# Altium project sme-pcb-energysolution-s01.PrjPcb
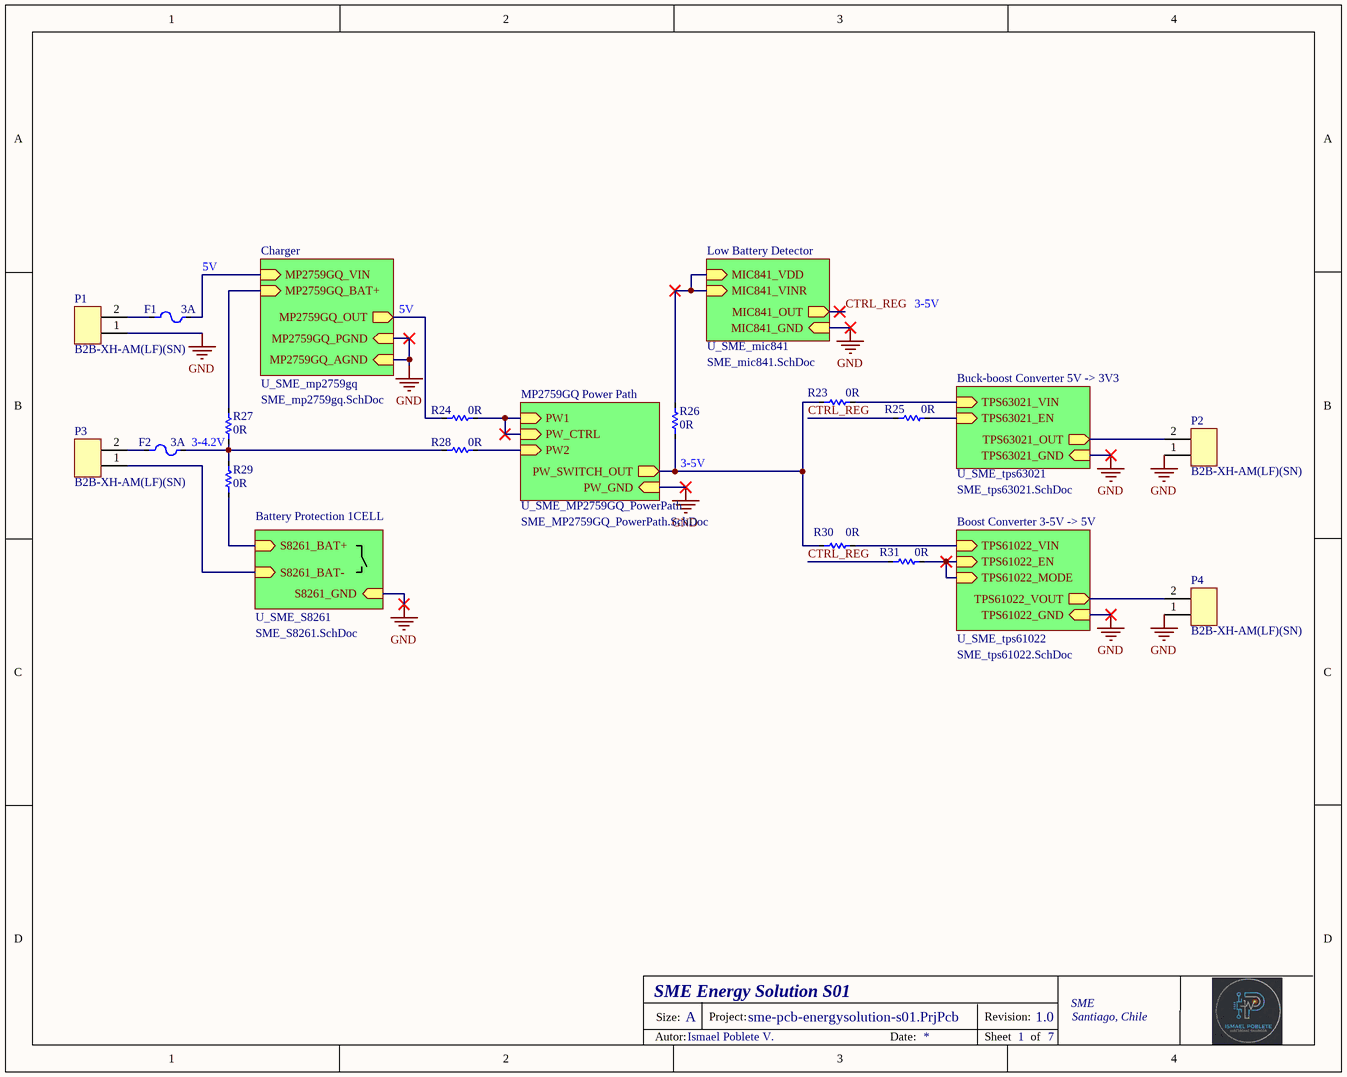
[diagram p0: SME_Main.SchDoc]
7 sheets, 73 parts. Net scope: hierarchical (ports join the sheet entries above them; power ports are global).
Board file: PCB_s01.PcbDoc
Sheets:
  SME_Main.SchDoc
    U_SME_mic841 = SME_mic841.SchDoc
    U_SME_S8261 = SME_S8261.SchDoc
    U_SME_mp2759gq = SME_mp2759gq.SchDoc
    U_SME_tps61022 = SME_tps61022.SchDoc
    U_SME_tps63021 = SME_tps63021.SchDoc
    U_SME_MP2759GQ_PowerPath = SME_MP2759GQ_PowerPath.SchDoc

## Sheet SME_Main.SchDoc: Titulo
size OrCAD A; Author: Ismael Poblete V.; CompanyName: SME; Organization: SME; Address1: Santiago, Chile; DocumentNumber: SME-UNO; Revision: 1.0; SheetNumber: 1; SheetTotal: 7

### Parts
F1  Fuse value: 3A  [Fuse 22.7mm - 2 Hole]  (hidden comment: FUSE - Littelfuse)
F2  Fuse value: 3A  [Fuse 22.7mm - 2 Hole]  (hidden comment: FUSE - Littelfuse)
P1  B2B-XH-AM(LF)(SN)  [2Pin JST XH-2.54mm]
P2  B2B-XH-AM(LF)(SN)  [2Pin JST XH-2.54mm]
P3  B2B-XH-AM(LF)(SN)  [2Pin JST XH-2.54mm]
P4  B2B-XH-AM(LF)(SN)  [2Pin JST XH-2.54mm]
R23  Resistance: 0R  [RES_1206]  (hidden comment: RC1206FR-070RL)
R24  Resistance: 0R  [RES_1206]  (hidden comment: RC1206FR-070RL)
R25  Resistance: 0R  [RES_1206]  (hidden comment: RC1206FR-070RL)
R26  Resistance: 0R  [RES_1206]  (hidden comment: RC1206FR-070RL)
R27  Resistance: 0R  [RES_1206]  (hidden comment: RC1206FR-070RL)
R28  Resistance: 0R  [RES_1206]  (hidden comment: RC1206FR-070RL)
R29  Resistance: 0R  [RES_1206]  (hidden comment: RC1206FR-070RL)
R30  Resistance: 0R  [RES_1206]  (hidden comment: RC1206FR-070RL)
R31  Resistance: 0R  [RES_1206]  (hidden comment: RC1206FR-070RL)

### Sub-sheets
U_SME_mic841 = SME_mic841.SchDoc: MIC841_VDD (in), MIC841_VINR (in), MIC841_OUT (out), MIC841_GND (in)
U_SME_mp2759gq = SME_mp2759gq.SchDoc: MP2759GQ_VIN (in), MP2759GQ_OUT (out), MP2759GQ_BAT+ (in), MP2759GQ_AGND (in), MP2759GQ_PGND (in)
U_SME_MP2759GQ_PowerPath = SME_MP2759GQ_PowerPath.SchDoc: PW_SWITCH_OUT (out), PW1 (in), PW2 (in), PW_CTRL (in), PW_GND (in)
U_SME_S8261 = SME_S8261.SchDoc: S8261_BAT+ (in), S8261_BAT- (in), S8261_GND (in)
U_SME_tps61022 = SME_tps61022.SchDoc: TPS61022_VIN (in), TPS61022_EN (in), TPS61022_MODE (in), TPS61022_VOUT (out), TPS61022_GND (in)
U_SME_tps63021 = SME_tps63021.SchDoc: TPS63021_VIN (in), TPS63021_OUT (out), TPS63021_EN (in), TPS63021_GND (in)

### Nets
GND: P1.1 P2.1 P4.1 ; sheet U_SME_mic841/MIC841_GND, sheet U_SME_S8261/S8261_GND, sheet U_SME_mp2759gq/MP2759GQ_AGND, sheet U_SME_mp2759gq/MP2759GQ_PGND, sheet U_SME_tps61022/TPS61022_GND, sheet U_SME_tps63021/TPS63021_GND, sheet U_SME_MP2759GQ_PowerPath/PW_GND  [project net MP2759GQ_AGND]
CTRL_REG: R25.1 R31.1 ; sheet U_SME_mic841/MIC841_OUT
MP2759GQ_BAT+: R27.2 ; sheet U_SME_mp2759gq/MP2759GQ_BAT+
MP2759GQ_VIN: F1.2 ; sheet U_SME_mp2759gq/MP2759GQ_VIN
NetC1_1: R23.2 ; sheet U_SME_tps63021/TPS63021_VIN
NetC3_1: P2.2 ; sheet U_SME_tps63021/TPS63021_OUT
NetC9_2: R24.1 ; sheet U_SME_mp2759gq/MP2759GQ_OUT
NetC13_1: R30.2 ; sheet U_SME_tps61022/TPS61022_VIN
NetC15_1: P4.2 ; sheet U_SME_tps61022/TPS61022_VOUT
NetC18_1: P3.1 ; sheet U_SME_S8261/S8261_BAT-
NetD2_1: R23.1 R24.2 R26.1 R30.1 ; sheet U_SME_MP2759GQ_PowerPath/PW_SWITCH_OUT, sheet U_SME_MP2759GQ_PowerPath/PW1, sheet U_SME_MP2759GQ_PowerPath/PW_CTRL
NetF1_1: F1.1 P1.2
NetF2_1: F2.1 P3.2
NetF2_2: F2.2 R27.1 R28.1 R29.2
NetQ3_3: R28.2 ; sheet U_SME_MP2759GQ_PowerPath/PW2
NetR1_2: R26.2 ; sheet U_SME_mic841/MIC841_VDD, sheet U_SME_mic841/MIC841_VINR
NetR8_1: R25.2 ; sheet U_SME_tps63021/TPS63021_EN
NetR21_1: R29.1 ; sheet U_SME_S8261/S8261_BAT+
NetR31_2: R31.2 ; sheet U_SME_tps61022/TPS61022_EN, sheet U_SME_tps61022/TPS61022_MODE

### Notes on the sheet
- (near F1) 5V
- Charger
- Low Battery Detector
- 5V
- 3-5V
- MP2759GQ Power Path
- (near R25) Buck-boost Converter 5V -> 3V3
- (near R27) 3-4.2V
- (near R26) 3-5V
- (near R29) Battery Protection 1CELL
- (near R31) Boost Converter 3-5V -> 5V
- SME Energy Solution S01
- Size:
- A
- Project:
- Revision:
- Autor:
- Date:
- Sheet
- of

### Library data of the parts
F1 F2 = FUSE - Littelfuse: LITTELFUSE WICKMANN - 64600001003 - FUSE HOLDER, 5 X 20MM, PCB MOUNT; Material: Tin; Body Material: Polyamide; Color: Black; Illumination Type: Illuminated; Number of Circuits: 1; Voltage: 250V; Fuse Current: 6.3A; Type: thru-hole; Supplier 1: Digi-Key; Supplier Part Number 1: WK6244-ND; Manufacturer: Littelfuse Wickmann; Manufacturer Part Number: 64600001003; RoHS: Yes; Category: Fuse Holders; Stock 1: 1999; Pricing 1: 1=0.84000, 5=0.81200, 10=0.76000, 50=0.62880, 100=0.52400, 250=0.51092, 500=0.43230, 1000=0.37990, 5000=0.34060 (USD); Mount: Horizontal,PCB; Number of Pins: 2; Min Operating Temperature: -25°C; Max Operating Temperature: 70°C; Termination: PC Pin; Voltage Rating (DC): 250V; Voltage Rating (AC): 250V; Current Rating: 6.3A; Package Quantity: 1000; Voltage Rating: 250V; Number of Poles: 1; Packaging: Bulk; Length: 25.8mm; Depth: 5.5mm; Width: 12mm; Flammability Rating: UL94 V-1; REACH SVHC: Unknown; Lead Free: Lead Free; ComponentLink1URL: https://datasheet.ciiva.com/14119/gqlittelfuse-sicherungshalter-646-en-14119833.pdf?src-supplier=Distrelec; ComponentLink1Description: https://datasheet.ciiva.com/14119/gqlittelfuse-sicherungshalter-646-en-14119833.pdf?src-supplier=Distrelec; ComponentLink2URL: https://datasheet.ciiva.com/25620/0900766b81196eda-25620105.pdf?src-supplier=RSComponents; ComponentLink2Description: https://datasheet.ciiva.com/25620/0900766b81196eda-25620105.pdf?src-supplier=RSComponents; ComponentLink3URL: https://datasheet.ciiva.com/23593/43388-23593468.pdf?src-supplier=Newark; ComponentLink3Description: https://datasheet.ciiva.com/23593/43388-23593468.pdf?src-supplier=Newark; ComponentLink4URL: https://datasheet.ciiva.com/1270/1480080-1270114.pdf?src-supplier=Element14; ComponentLink4Description: https://datasheet.ciiva.com/1270/1480080-1270114.pdf?src-supplier=Element14; ComponentLink5URL: https://datasheet.ciiva.com/4480/646-648-640-lf-050901-4480295.pdf?src-supplier=Mouser; ComponentLink5Description: https://datasheet.ciiva.com/4480/646-648-640-lf-050901-4480295.pdf?src-supplier=Mouser; ComponentLink6URL: https://datasheet.ciiva.com/7660/646-648-640-lf-050901-7660727.pdf?src-supplier=Element14; ComponentLink6Description: https://datasheet.ciiva.com/7660/646-648-640-lf-050901-7660727.pdf?src-supplier=Element14; ComponentLink7URL: https://datasheet.ciiva.com/295/646-648-640-lf-050901-295754.pdf?src-supplier=Digi-Key; ComponentLink7Description: https://datasheet.ciiva.com/295/646-648-640-lf-050901-295754.pdf?src-supplier=Digi-Key; ComponentLink8URL: https://datasheet.ciiva.com/15187/getdatasheetpartid-57320-15187869.pdf?src-supplier=Verical; ComponentLink8Description: https://datasheet.ciiva.com/15187/getdatasheetpartid-57320-15187869.pdf?src-supplier=Verical; Package: 2 Pos
P1-P4 = B2B-XH-AM(LF)(SN): CONN HEADER VERT 2POS 2.5MM
R23-R31 = RC1206FR-070RL: Thick Film Resistors - SMD 0 Ohms 250 mW 1206 1%; Manufacturer_Name: Yageo Group; Geometry.Height: 0.65mm; Mouser Part Number: 603-RC1206FR-070RL; Mouser Price/Stock: https://www.mouser.co.uk/ProductDetail/YAGEO/RC1206FR-070RL?qs=%2FbpERZPLKKvgeF8VBtNQLg%3D%3D; Manufacturer_Part_Number: RC1206FR-070RL; Datasheet Link: https://www.yageogroup.com/content/datasheet/asset/file/PYU-RC_GROUP_51_ROHS_L; Case/Package: 1206; Manufacturer: Yageo Group; Package: 1206; Type: SMD; Manufacturer Part Number: RC1206FR-070RL

## Sheet SME_mic841.SchDoc: Titulo
size OrCAD A; Author: Ismael Poblete V.; CompanyName: SME; Organization: SME; Address1: Santiago, Chile; DocumentNumber: SME-UNO; Revision: 1.0; SheetNumber: 2; SheetTotal: 7
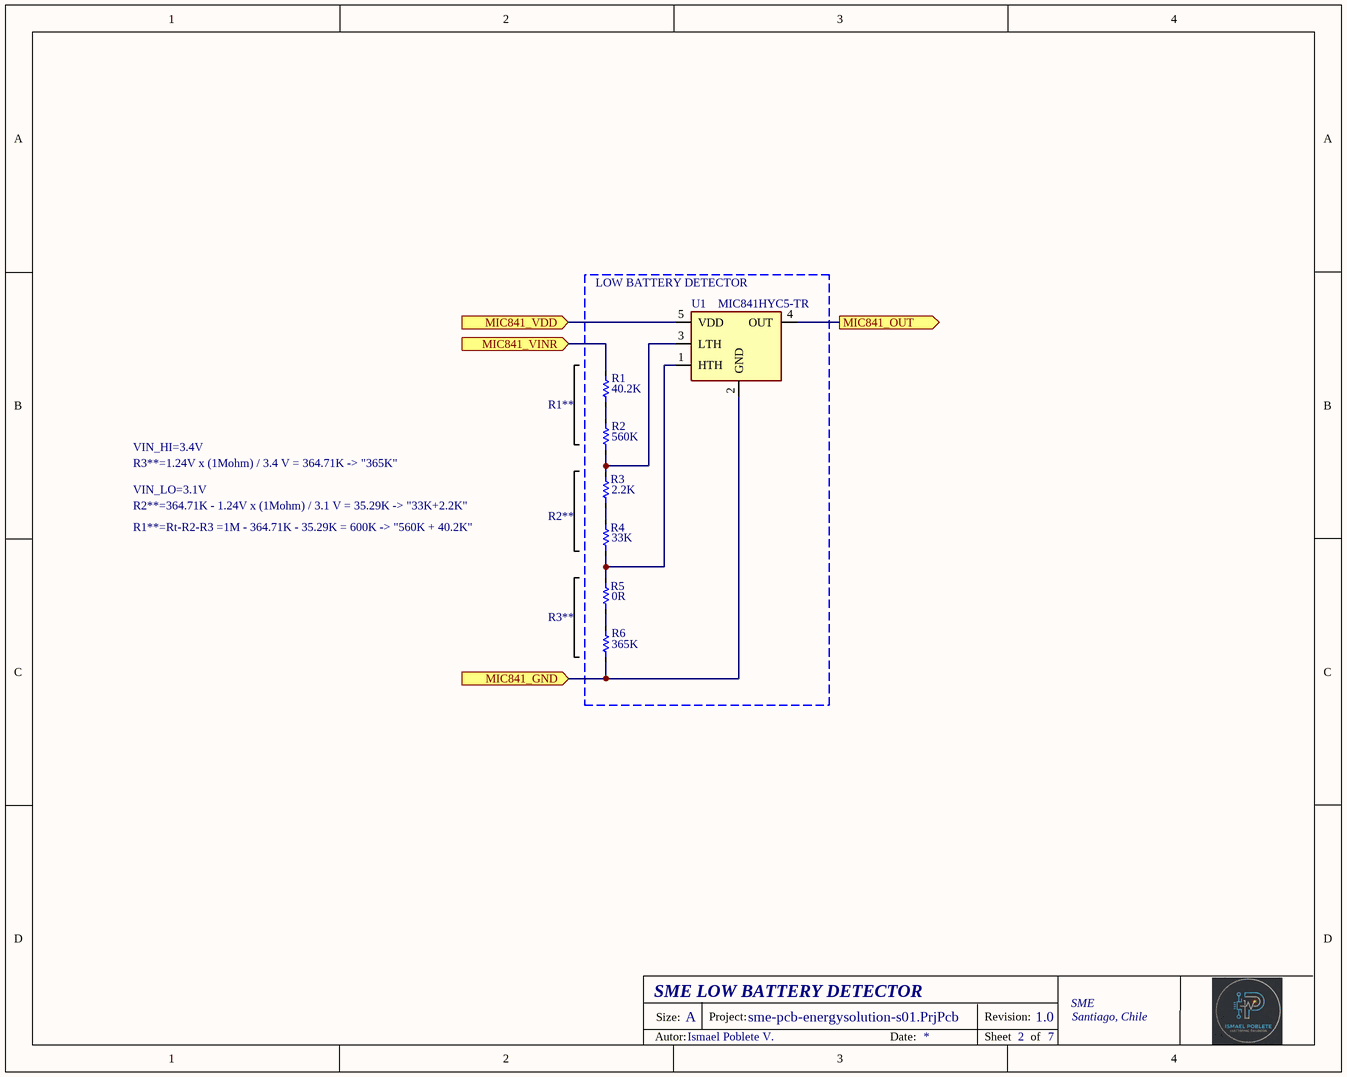
[diagram p1: SME_mic841.SchDoc]

### Parts
R1  Resistance: 40.2K  [RES_0805]  (hidden comment: RT0805FRE0740K2L)
R2  Resistance: 560K  [RES_0805]  (hidden comment: RT0805FRE07560KL)
R3  Resistance: 2.2K  [RES_0805]  (hidden comment: RT0805FRE072K2L)
R4  Resistance: 33K  [RES_0805]  (hidden comment: RT0805FRE0733KL)
R5  Resistance: 0R  [RES_0805]  (hidden comment: RC0805FR-100RL)
R6  Resistance: 365K  [RES_0805]  (hidden comment: RT0805FRE07365KL)
U1  MIC841HYC5-TR  [SOT65P210X110-5N]

### Blocks framed on the sheet
LOW BATTERY DETECTOR: R1-R6 U1

### Ports
MIC841_GND (in, see SME_Main[3B]), MIC841_OUT (out, see SME_Main[3B]), MIC841_VDD (in, see SME_Main[3B]), MIC841_VINR (in, see SME_Main[3B])

### Nets
MP2759GQ_AGND: R6.1 U1.2(GND) ; port MIC841_GND
CTRL_REG: U1.4(OUT) ; port MIC841_OUT
NetR1_1: R1.1 R2.2
NetR1_2: R1.2 U1.5(VDD) ; port MIC841_VDD, port MIC841_VINR
NetR2_1: R2.1 R3.2 U1.3(LTH)
NetR3_1: R3.1 R4.2
NetR4_1: R4.1 R5.2 U1.1(HTH)
NetR5_1: R5.1 R6.2

### Notes on the sheet
- R1**
- VIN_LO=3.1V
- VIN_HI=3.4V
- R3**=1.24V x (1Mohm) / 3.4 V = 364.71K -> "365K"
- R2**=364.71K - 1.24V x (1Mohm) / 3.1 V = 35.29K -> "33K+2.2K"
- R1**=Rt-R2-R3 =1M - 364.71K - 35.29K = 600K -> "560K + 40.2K"
- R2**
- R3**
- SME LOW BATTERY DETECTOR
- Size:
- A
- Project:
- Revision:
- Autor:
- Date:
- Sheet
- of

### Library data of the parts
R1 = RT0805FRE0740K2L: Thin Film Resistors - SMD 1/8W 40.2K ohm 1% 50ppm; Case/Package: 0805
R2 = RT0805FRE07560KL: Thin Film Resistors - SMD 1/8W 560K ohm 1% 50ppm; Case/Package: 0805
R3 = RT0805FRE072K2L: Thin Film Resistors - SMD 1/8W 2.2K ohm 1% 50p pm; Case/Package: 0805
R4 = RT0805FRE0733KL: Thin Film Resistors - SMD 1/8W 33K ohm 1% 50ppm; Case/Package: 0805
R5 = RC0805FR-100RL: Thick Film Resistors - SMD General Purpose Chip Resistor 0805, 0Ohms, 1%, 1/8W; Case/Package: 0805
R6 = RT0805FRE07365KL: Thin Film Resistors - SMD 1/8W 365K ohm 1% 50ppm; Case/Package: 0805
U1 = MIC841HYC5-TR: Microchip MIC841HYC5-TR Dual Comparator, Open Drain, Push-Pull O/P, 12us 1.5  5.5 V 5-Pin SC-70; Geometry.Height: 1.1mm; Mouser Part Number: 998-MIC841HYC5TR; Mouser Price/Stock: https://www.mouser.co.uk/ProductDetail/Microchip-Technology/MIC841HYC5-TR?qs=U6T8BxXiZAVOe5BH1VWqpQ%3D%3D; Manufacturer_Name: Microchip; Manufacturer_Part_Number: MIC841HYC5-TR; Datasheet Link: http://ww1.microchip.com/downloads/en/devicedoc/20005758a.pdf

## Sheet SME_S8261.SchDoc: Titulo
size OrCAD A; Author: Ismael Poblete V.; CompanyName: SME; Organization: SME; Address1: Santiago, Chile; DocumentNumber: SME-UNO; Revision: 1.0; SheetNumber: 6; SheetTotal: 7
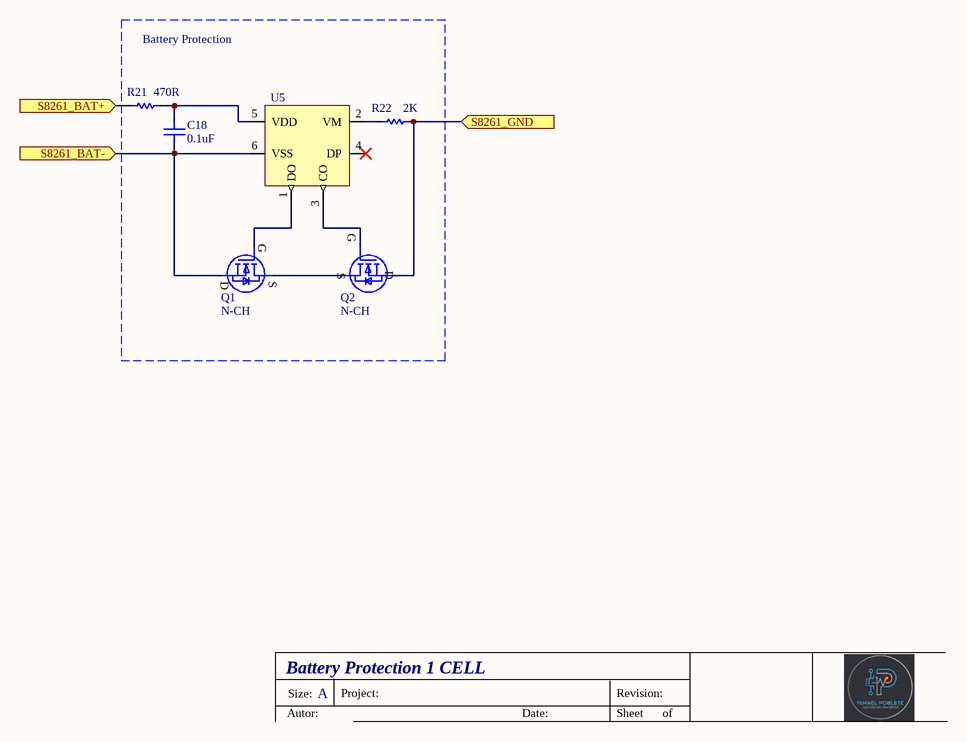
[diagram p2: SME_S8261.SchDoc]

### Parts
C18  Capacitance: 0.1uF  [C0603]  (hidden comment: CC0603KRX7R9BB104)
Q1  N-CH  [PowerPAK 1212-8-Pad]
Q2  N-CH  [PowerPAK 1212-8-Pad]
R21  Resistance: 470R  [RES_0603]  (hidden comment: RC0603FR-07470RL)
R22  Resistance: 2K  [RES_0603]  (hidden comment: RT0603DRD072KL)
U5  S-8261AAXMD-G2XT2U  [SOT95P275X135-6N]  (value not drawn)

### Blocks framed on the sheet
Battery Protection: C18 Q1 Q2 R21 R22 U5

### Ports
S8261_BAT+ (in, see SME_Main[1C]), S8261_BAT- (in, see SME_Main[1C]), S8261_GND (in, see SME_Main[2C])

### Nets
MP2759GQ_AGND: Q2.3(D) R22.2 ; port S8261_GND
NetC18_1: C18.1 Q1.3(D) U5.6(VSS) ; port S8261_BAT-
NetC18_2: C18.2 R21.2 U5.5(VDD)
NetQ1_1: Q1.1(S) Q2.1(S)
NetQ1_2: Q1.2(G) U5.1(DO)
NetQ2_2: Q2.2(G) U5.3(CO)
NetR21_1: R21.1 ; port S8261_BAT+
NetR22_1: R22.1 U5.2(VM)

Not connected (* = marked no-connect by the designer): U5 4(DP)*

### Notes on the sheet
- Battery Protection 1 CELL
- Size:
- A
- Project:
- Revision:
- Autor:
- Date:
- Sheet
- of

### Library data of the parts
C18 = CC0603KRX7R9BB104: Multilayer Ceramic Capacitors MLCC - SMD/SMT 50 V 0.1uF X7R 0603 10%
Q1 Q2 = SI7106DN-T1-GE3: MOSFET (N-Channel); Manufacturer_Name: Vishay; Datasheet Link: https://www.arrow.com/en/products/si7106dn-t1-ge3/vishay; Height: 1.12mm; Manufacturer_Part_Number: SI7106DN-T1-GE3; Mouser Part Number: 781-SI7106DN-T1-GE3; Mouser Price/Stock: https://www.mouser.co.uk/ProductDetail/Vishay-Semiconductors/SI7106DN-T1-GE3?qs=tWM4QuTcS4UXbO9qkz0xcQ%3D%3D; Arrow Part Number: SI7106DN-T1-GE3; Arrow Price/Stock: https://www.arrow.com/en/products/si7106dn-t1-ge3/vishay?region=nac; ComponentLink1Description: New link; ComponentLink1URL: https://www.mouser.com/ProductDetail/Vishay-Semiconductors/SI7106DN-T1-GE3?qs=tWM4QuTcS4UXbO9qkz0xcQ%3D%3D
R21 = RC0603FR-07470RL: 470 Ohms ±1% 0.1W, 1/10W Chip Resistor 0603 (1608 Metric) Moisture Resistant Thick Film; Case/Package: 0603
R22 = RT0603DRD072KL: Thin Film Resistors - SMD 2K Ohm 0.5% 1/10W 75 Volts 25ppm; Case/Package: 0603
U5 = S-8261AAXMD-G2XT2U: Battery Battery Protection IC Lithium Ion/Polymer SOT-23-6

## Sheet SME_mp2759gq.SchDoc: Titulo
size OrCAD A; Author: Ismael Poblete V.; CompanyName: SME; Organization: SME; Address1: Santiago, Chile; DocumentNumber: SME-UNO; Revision: 1.0; SheetNumber: 4; SheetTotal: 7
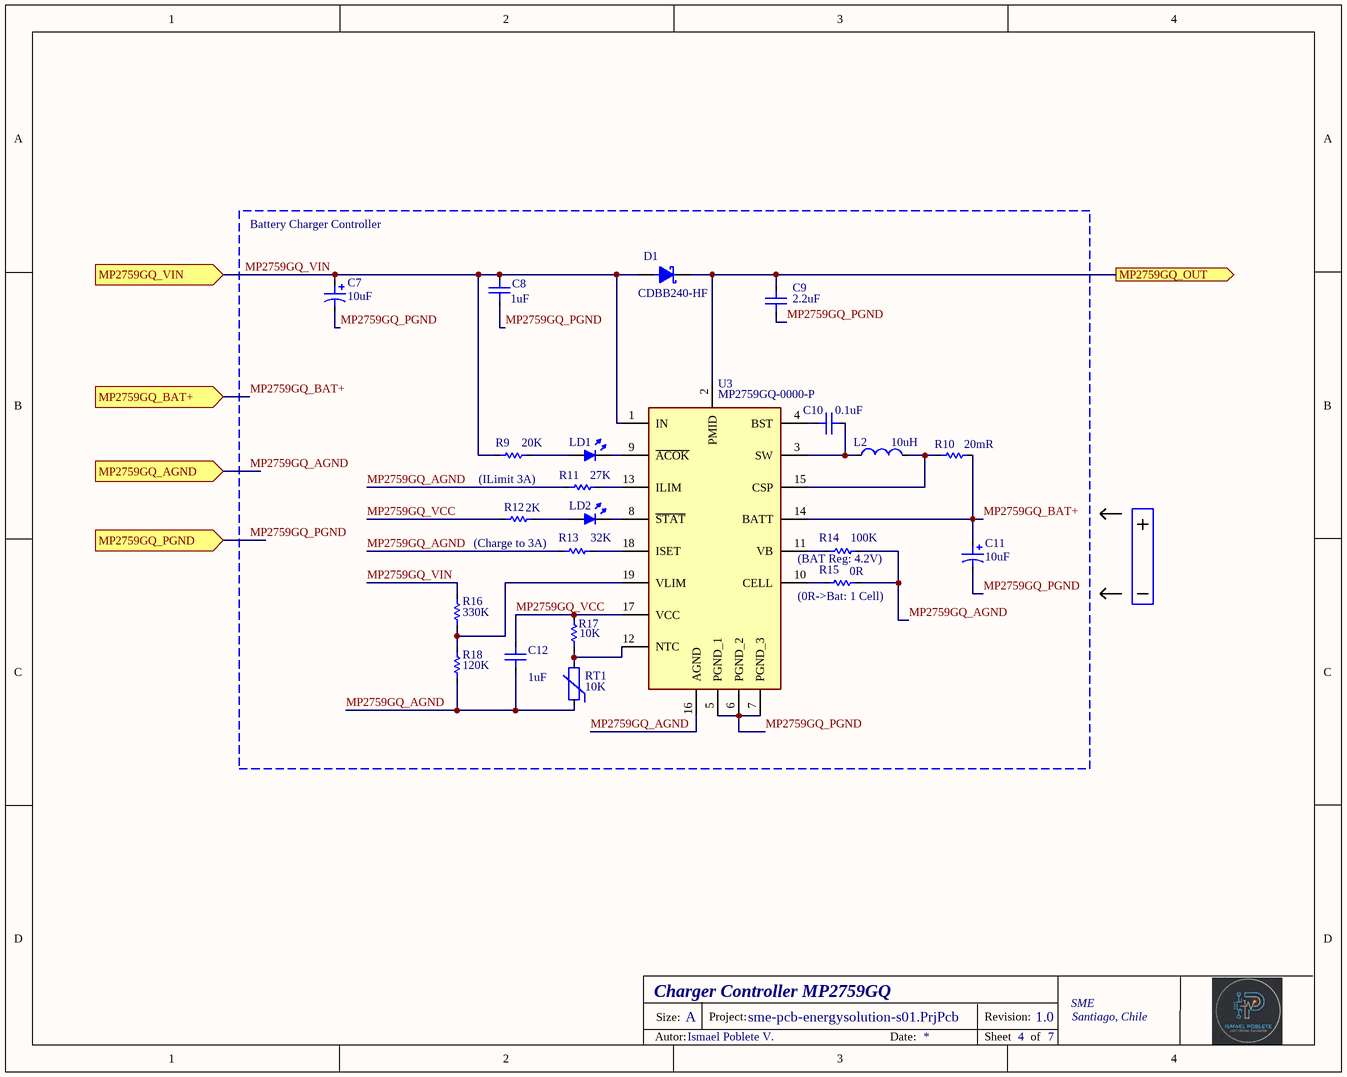
[diagram p3: SME_mp2759gq.SchDoc]

### Parts
C7  Capacitance: 10uF  [CASE_A]  (hidden comment: T491A106M016AT)
C8  Capacitance: 1uF  [C0603]  (hidden comment: CC0603KRX5R6BB105)
C9  Capacitance: 2.2uF  [C0603]  (hidden comment: CC0603KRX7R5BB225)
C10  Capacitance: 0.1uF  [C0603]  (hidden comment: CC0603KRX7R9BB104)
C11  Capacitance: 10uF  [CASE_A]  (hidden comment: T491A106M016AT)
C12  Capacitance: 1uF  [C0603]  (hidden comment: CC0603KRX5R6BB105)
D1  CDBB240-HF  [DO-214AA-2]
L2  10uH  [5050 _H4mm]
LD1  HSMS-C170  [LED_0805_WHITE]  (value not drawn)
LD2  HSMS-C170  [LED_0805_WHITE]  (value not drawn)
R9  Resistance: 20K  [RES_0603]  (hidden comment: RT0603FRE0720KL)
R10  Resistance: 20mR  [RES_1206]  (hidden comment: PE1206FRE470R02L)
R11  Resistance: 27K  [RES_0603]  (hidden comment: RT0603FRE0727KL)
R12  Resistance: 2K  [RES_0603]  (hidden comment: RT0603FRE072KL)
R13  Resistance: 32K  [RES_0603]  (hidden comment: RT0603BRD0732KL)
R14  Resistance: 100K  [RES_0603]  (hidden comment: RT0603FRD07100KL)
R15  Resistance: 0R  [RES_0805]  (hidden comment: RC0805FR-100RL)
R16  Resistance: 330K  [RES_0603]  (hidden comment: RT0603DRD07330KL)
R17  Resistance: 10K  [RES_0603]  (hidden comment: RT0603FRE0710KL)
R18  Resistance: 120K  [RES_0603]  (hidden comment: RT0603BRD07120KL)
RT1  Resistance: 10K  [103AT2]  (hidden comment: 103AT-2)
U3  MP2759GQ-0000-P  [QFN19_MP2759GQ0000P]

### Ports
MP2759GQ_AGND (in, see SME_Main[2B]), MP2759GQ_BAT+ (in, see SME_Main[1B]), MP2759GQ_OUT (out, see SME_Main[2B]), MP2759GQ_PGND (in, see SME_Main[2B]), MP2759GQ_VIN (in, see SME_Main[1B])

### Nets
MP2759GQ_AGND: C7.2 C8.1 C9.1 C11.2 C12.1 R11.1 R13.1 R14.2 R15.1 R18.1 RT1.1 U3.5(PGND_1) U3.6(PGND_2) U3.7(PGND_3) U3.16(AGND) ; port MP2759GQ_AGND, port MP2759GQ_PGND  [also labelled MP2759GQ_PGND]
MP2759GQ_BAT+: C11.1 R10.2 U3.14(BATT) ; port MP2759GQ_BAT+
MP2759GQ_VCC: C12.2 R12.1 R17.2 U3.17(VCC)
MP2759GQ_VIN: C7.1 C8.2 D1.1(A) R9.1 R16.2 U3.1(IN) ; port MP2759GQ_VIN
NetC9_2: C9.2 D1.2(K) U3.2(PMID) ; port MP2759GQ_OUT
NetC10_1: C10.1 L2.1 U3.3(SW)
NetC10_2: C10.2 U3.4(BST)
NetL2_2: L2.2 R10.1 U3.15(CSP)
NetLD1_1: LD1.1(A) R9.2
NetLD1_2: LD1.2(K) U3.9(~{ACOK})
NetLD2_1: LD2.1(A) R12.2
NetLD2_2: LD2.2(K) U3.8(~{STAT})
NetR11_2: R11.2 U3.13(ILIM)
NetR13_2: R13.2 U3.18(ISET)
NetR14_1: R14.1 U3.11(VB)
NetR15_2: R15.2 U3.10(CELL)
NetR16_1: R16.1 R18.2 U3.19(VLIM)
NetR17_1: R17.1 RT1.2 U3.12(NTC)

### Notes on the sheet
- (near C7) Battery Charger Controller
- (ILimit 3A)
- (near R13) (Charge to 3A)
- (near R15) (0R->Bat: 1 Cell)
- (near R14) (BAT Reg: 4.2V)
- Charger Controller MP2759GQ
- Size:
- A
- Project:
- Revision:
- Autor:
- Date:
- Sheet
- of

### Library data of the parts
C7 C11 = T491A106M016AT: KEMET - T491A106M016AT - Surface Mount Tantalum Capacitor, 10 µF, 16 V, 1206 [3216 Metric], T491 Series, ± 20%, -55 °C; Manufacturer: Yageo Group; Material: Ceramic; Tolerance: 10%; Dielectric: X5R; Voltage Rating (DC): 10V; ESR (Equivalent Series Resistance): 7R; Life (Hours): 2000Hour; Dissipation Factor: 8%; Leakage Current: 1.6uA; Polarity: Polar; Ripple Current: 104mA; Voltage: 16V; Type: SMD; Supplier 1: Digi-Key; Supplier Part Number 1: 1276-1192-1-ND; Manufacturer Part Number: T491A106M016AT; RoHS: Yes; Category: Ceramic Capacitors; Stock 1: 1573745; Pricing 1: 1=0.19000, 10=0.13200, 50=0.07940, 100=0.06700, 500=0.04588, 1000=0.04058 (USD); Mount: Surface Mount; Case/Package: 0603; Case Code (Metric): 1608; Case Code (Imperial): 0603; Contact Plating: Tin; Min Operating Temperature: -55°C; Max Operating Temperature: 85°C; Package Quantity: 1; Packaging: Tape and Reel; Voltage Rating: 10V; Length: 1.6mm; Height: 0.8mm; Thickness: 0.035inch; Depth: 0.8mm; Width: 0.031inch; Radiation Hardening: No; Lead Free: Lead Free; ComponentLink1URL: https://datasheet.ciiva.com/26877/getdatasheetpartid-359551-26877881.pdf?src-supplier=Verical; ComponentLink1Description: https://datasheet.ciiva.com/26877/getdatasheetpartid-359551-26877881.pdf?src-supplier=Verical; ComponentLink2URL: https://datasheet.ciiva.com/29198/457369-da-01-en-vs-kondensator-0603-29198790.pdf?src-supplier=Conrad; ComponentLink2Description: https://datasheet.ciiva.com/29198/457369-da-01-en-vs-kondensator-0603-29198790.pdf?src-supplier=Conrad; ComponentLink3URL: https://datasheet.ciiva.com/16200/cl05b104kq5nnnc-16200766.pdf?src-supplier=Future+Electronics; ComponentLink3Description: https://datasheet.ciiva.com/16200/cl05b104kq5nnnc-16200766.pdf?src-supplier=Future+Electronics; Supplier 2: Digi-Key; Supplier Part Number 2: 399-3687-1-ND; Stock 2: 249031; Pricing 2: 1=0.43000, 10=0.29900, 50=0.20940, 100=0.17950, 500=0.13464, 1000=0.11370 (USD); Dielectric Material: Tantalum; Features: General Purpose; Termination: SMD/SMT; Height - Seated (Max): 0.071inch; Lead Pitch: 1.2mm; REACH SVHC: No SVHC; ComponentLink4URL: https://datasheet.ciiva.com/27092/1573281-27092884.pdf?src-supplier=Jameco; ComponentLink4Description: https://datasheet.ciiva.com/27092/1573281-27092884.pdf?src-supplier=Jameco; ComponentLink5URL: https://datasheet.ciiva.com/7696/1732759-7696297.pdf?src-supplier=Element14; ComponentLink5Description: https://datasheet.ciiva.com/7696/1732759-7696297.pdf?src-supplier=Element14; ComponentLink6URL: https://datasheet.ciiva.com/7696/1854511-7696298.pdf?src-supplier=Element14; ComponentLink6Description: https://datasheet.ciiva.com/7696/1854511-7696298.pdf?src-supplier=Element14; ComponentLink7URL: https://datasheet.ciiva.com/257/kem-t2005-t491-257611.pdf?src-supplier=Digi-Key; ComponentLink7Description: https://datasheet.ciiva.com/257/kem-t2005-t491-257611.pdf?src-supplier=Digi-Key; ComponentLink8URL: https://datasheet.ciiva.com/5934/kem-t2005-t491-5934795.pdf?src-supplier=Farnell; ComponentLink8Description: https://datasheet.ciiva.com/5934/kem-t2005-t491-5934795.pdf?src-supplier=Farnell; ComponentLink9URL: https://datasheet.ciiva.com/257/kem-t2005-t491-257612.pdf?src-supplier=Digi-Key; ComponentLink9Description: https://datasheet.ciiva.com/257/kem-t2005-t491-257612.pdf?src-supplier=Digi-Key; ComponentLink10URL: https://datasheet.ciiva.com/257/kem-t2005-t491-257613.pdf?src-supplier=Digi-Key; ComponentLink10Description: https://datasheet.ciiva.com/257/kem-t2005-t491-257613.pdf?src-supplier=Digi-Key; ComponentLink11URL: https://datasheet.ciiva.com/12883/kem-t2005-t491-12883118.pdf?src-supplier=Mouser; ComponentLink11Description: https://datasheet.ciiva.com/12883/kem-t2005-t491-12883118.pdf?src-supplier=Mouser; ComponentLink12URL: https://datasheet.ciiva.com/14589/70095774-14589054.pdf?src-supplier=Allied+Electronics; ComponentLink12Description: https://datasheet.ciiva.com/14589/70095774-14589054.pdf?src-supplier=Allied+Electronics; ComponentLink13URL: https://datasheet.ciiva.com/14597/70095774-14597406.pdf?src-supplier=Allied+Electronics; ComponentLink13Description: https://datasheet.ciiva.com/14597/70095774-14597406.pdf?src-supplier=Allied+Electronics; Package: A Case
C8 C12 = CC0603KRX5R6BB105: Multilayer Ceramic Capacitors MLCC - SMD/SMT 10V 1uF X5R 0603 10% HI CV; Manufacturer: Yageo Group; Type: SMD; Package: 0603; Manufacturer Part Number: CC0603KRX5R6BB105
C9 = CC0603KRX7R5BB225: Multilayer Ceramic Capacitors MLCC - SMD/SMT 6.3V 2.2uF X7R 0603 10% HI CV
C10 = CC0603KRX7R9BB104: Multilayer Ceramic Capacitors MLCC - SMD/SMT 50 V 0.1uF X7R 0603 10%; Manufacturer: Yageo Group; Type: SMD; Package: 0603; Manufacturer Part Number: CC0603KRX7R9BB104
D1 = CDBB240-HF: Schottky Diode; Manufacturer_Name: Comchip Technology; Manufacturer: Comchip; Type: SMD; Datasheet Link: https://datasheet.datasheetarchive.com/originals/distributors/DKDS41/DSANUWW0021461.pdf; Height: 3.2mm; Manufacturer_Part_Number: CDBB240-HF; Mouser Part Number: 750-CDBB240-HF; Mouser Price/Stock: https://www.mouser.co.uk/ProductDetail/Comchip-Technology/CDBB240-HF?qs=%252BiOMRfgENTHvuVH5OF%252BwbA%3D%3D; Arrow Part Number: CDBB240-HF; Arrow Price/Stock: https://www.arrow.com/en/products/cdbb240-hf/comchip-technology?region=nac; Package: DO-214AA-2; Manufacturer Part Number: CDBB240-HF
L2 = SRR1240-100M: Power Inductors - SMD 10uH 20% SMD 1240; Manufacturer_Name: Bourns; Manufacturer: Samsung Electro-Mechanics; Manufacturer Part Number: CIGT201210UHR47MNE; Datasheet Link: https://www.mouser.it/datasheet/2/54/SRR1240-1391459.pdf; Height: 4.5mm; Manufacturer_Part_Number: SRR1240-100M; Mouser Part Number: 652-SRR1240-100M; Mouser Price/Stock: https://www.mouser.co.uk/ProductDetail/Bourns/SRR1240-100M?qs=uD%2FoUDWqfvRyQbveYihOGw%3D%3D; Arrow Part Number: SRR1240-100M; Arrow Price/Stock: https://www.arrow.com/en/products/srr1240-100m/bourns?region=europe; ComponentLink1Description: New link; ComponentLink1URL: https://www.mouser.com/ProductDetail/Bourns/SRR1240-100M?qs=uD%2FoUDWqfvRyQbveYihOGw%3D%3D; Package: 0805; Type: SMD
LD1 LD2 = HSMS-C170: Single Color LEDs Red Diffused 626nm 10mcd; Manufacturer: Broadcom; Type: SMD; Package: HSMS-C170; Manufacturer Part Number: HSMS-C170
R9 = RT0603FRE0720KL: Thin Film Resistors - SMD 1/10W 20K ohm 1% 50ppm; Manufacturer: Yageo Group; Case/Package: 0603; Package: 0603; Type: SMD; Manufacturer Part Number: RT0603FRE0720KL
R10 = PE1206FRE470R02L: Current Sense Resistors - SMD 20 mOhms 1 W 50PPM/C 1206; Manufacturer: Yageo Group; Package: 1206; Type: SMD; Manufacturer Part Number: PE1206FRE470R02L
R11 = RT0603FRE0727KL: Thin Film Resistors - SMD 1/10W 27K ohm 1% 50ppm; Manufacturer: Yageo Group; Case/Package: 0603; Package: 0603; Type: SMD; Manufacturer Part Number: RT0603FRE0727KL
R12 = RT0603FRE072KL: Thin Film Resistors - SMD 1/10W 2K ohm 1% 50ppm; Case/Package: 0603
R13 = RT0603BRD0732KL: Thin Film Resistors - SMD 1/10W 32K Ohms 0.1%; Manufacturer: Yageo Group; Case/Package: 0603; Package: 0603; Type: SMD; Manufacturer Part Number: RT0603BRD0732KL
R14 = RT0603FRD07100KL: Thin Film Resistors - SMD 100K OHM 1% 25PPM 1/10W; Manufacturer: Yageo Group; Case/Package: 0603; Package: 0603; Type: SMD; Manufacturer Part Number: RT0603FRD07100KL
R15 = RC0805FR-100RL: Thick Film Resistors - SMD General Purpose Chip Resistor 0805, 0Ohms, 1%, 1/8W; Manufacturer: Yageo Group; Manufacturer Part Number: RC0805FR-10100RL; Case/Package: 0805; Package: 0805; Type: SMD
R16 = RT0603DRD07330KL: Thin Film Resistors - SMD 330K OHM .5% 25PPM 1/10W
R17 = RT0603FRE0710KL: Thin Film Resistors - SMD 10K ohm 1% 1/10W; Manufacturer: Yageo Group; Case/Package: 0603; Package: 0603; Type: SMD; Manufacturer Part Number: RT0603FRE0710KL
R18 = RT0603BRD07120KL: Thin Film Resistors - SMD 1/10W 120K ohm .1% 25ppm
RT1 = 103AT-2: NTC Thermistors 10kohm 1%; Manufacturer: Semitec; Package: 2 Pos; Type: thru-hole; Manufacturer Part Number: 103AT-2
U3 = MP2759GQ-0000-P: Integrated Circuit; Manufacturer_Name: Monolithic Power Systems (MPS); Manufacturer: Monolithic Power Systems; Datasheet Link: https://www.monolithicpower.cn/cn/documentview/productdocument/index/version/2/document_type/Datasheet/lang/en/sku/MP2759GQ/; Height: 1mm; Manufacturer_Part_Number: MP2759GQ-0000-P; Mouser Part Number: 946-MP2759GQ-0000-P; Mouser Price/Stock: https://www.mouser.co.uk/ProductDetail/Monolithic-Power-Systems-MPS/MP2759GQ-0000-P?qs=QNEnbhJQKvaMJpbzSVzajw%3D%3D; Package: QFN-19; Type: SMD; Manufacturer Part Number: MP2759GQ-0000-P

## Sheet SME_tps61022.SchDoc: Titulo
size OrCAD A; Author: Ismael Poblete V.; CompanyName: SME; Organization: SME; Address1: Santiago, Chile; DocumentNumber: SME-UNO; Revision: 1.0; SheetNumber: 5; SheetTotal: 7
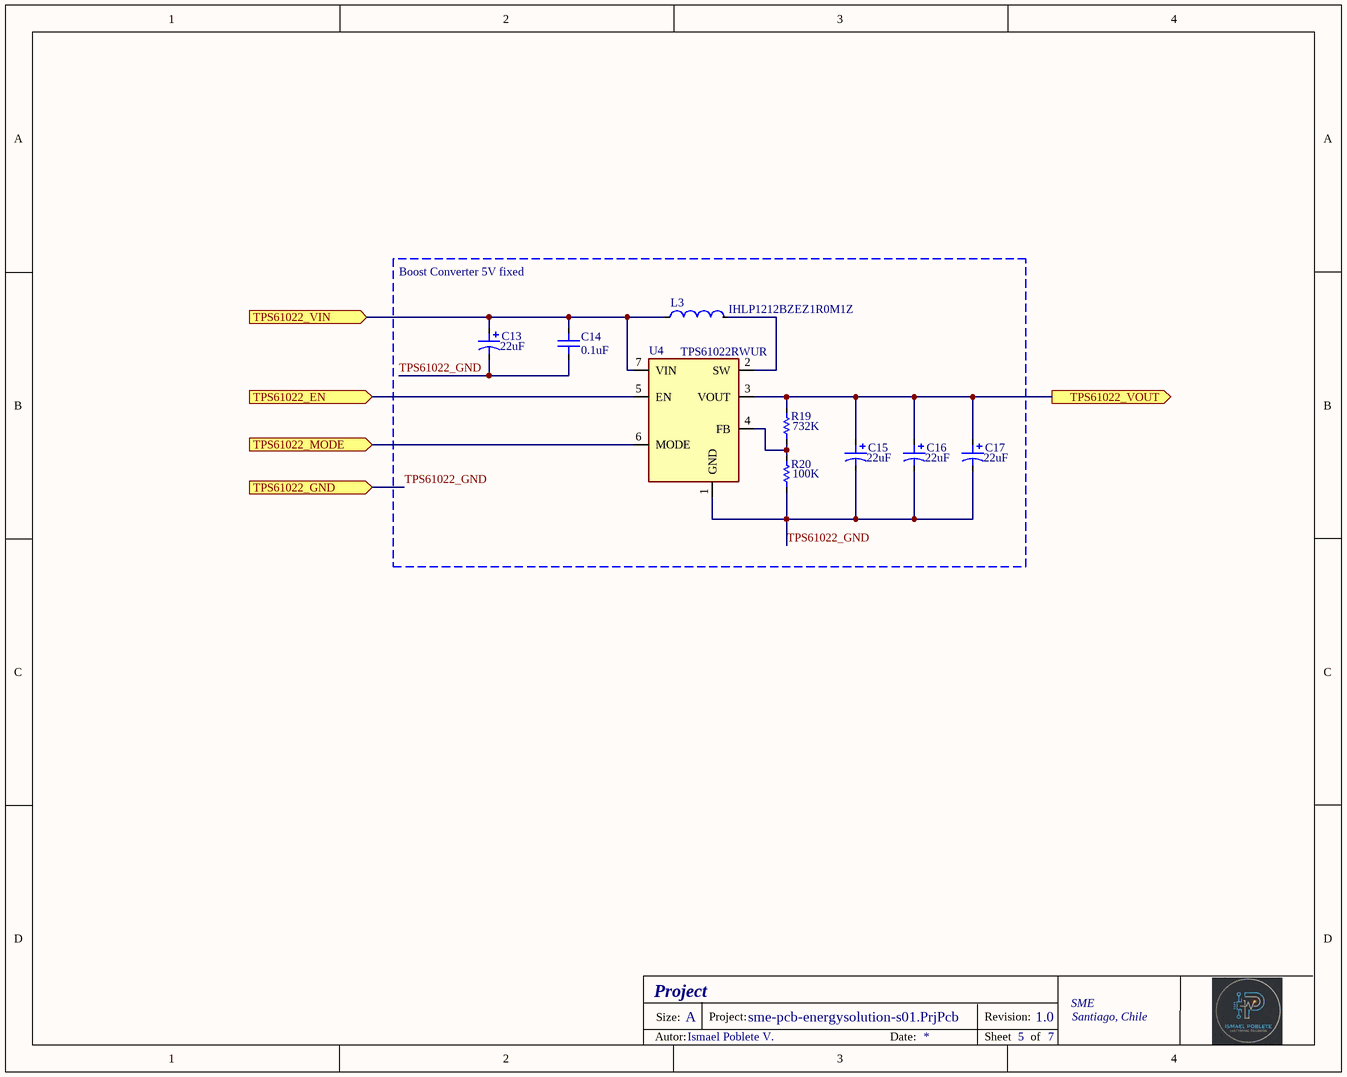
[diagram p4: SME_tps61022.SchDoc]

### Parts
C13  Capacitance: 22uF  [T491B / CASE_B]  (hidden comment: T491B226K006AT)
C14  Capacitance: 0.1uF  [C0603]  (hidden comment: CC0603KRX7R9BB104)
C15  Capacitance: 22uF  [T491B / CASE_B]  (hidden comment: T491B226K006AT)
C16  Capacitance: 22uF  [T491B / CASE_B]  (hidden comment: T491B226K006AT)
C17  Capacitance: 22uF  [T491B / CASE_B]  (hidden comment: T491B226K006AT)
L3  IHLP1212BZEZ1R0M1Z  [INDPM3030X200N]
R19  Resistance: 732K  [RES_0805]  (hidden comment: RT0805BRD07732KL)
R20  Resistance: 100K  [RES_0603]  (hidden comment: RT0603FRD07100KL)
U4  TPS61022RWUR  [7-Pin VQFN w thermal]

### Blocks framed on the sheet
Boost Converter 5V fixed: C13-C17 L3 R19 R20 U4

### Ports
TPS61022_EN (in, see SME_Main[3C]), TPS61022_GND (in, see SME_Main[4C]), TPS61022_MODE (in, see SME_Main[3C]), TPS61022_VIN (in, see SME_Main[3C]), TPS61022_VOUT (out, see SME_Main[4C])

### Nets
TPS61022_GND: C13.2 C14.1 C15.2 C16.2 C17.2 R20.1 U4.1(GND) ; port TPS61022_GND  [project net MP2759GQ_AGND]
NetC13_1: C13.1 C14.2 L3.1 U4.7(VIN) ; port TPS61022_VIN
NetC15_1: C15.1 C16.1 C17.1 R19.2 U4.3(VOUT) ; port TPS61022_VOUT
NetL3_2: L3.2 U4.2(SW)
NetR19_1: R19.1 R20.2 U4.4(FB)
NetR31_2: U4.5(EN) U4.6(MODE) ; port TPS61022_EN, port TPS61022_MODE

### Notes on the sheet
- Project
- Size:
- A
- Project:
- Revision:
- Autor:
- Date:
- Sheet
- of

### Library data of the parts
C13 C15-C17 = T491B226K006AT: Tantalum Capacitors - Solid SMD 6.3V 22uF 1311 10% ESR=3.5ohms
C14 = CC0603KRX7R9BB104: as C18 on sheet SME_S8261
L3 = IHLP1212BZEZ1R0M1Z: 1 H Shielded Molded Inductor 8.4 A 20mOhm Max 1212 (3030 Metric); Manufacturer_Name: Vishay; Geometry.Height: 2mm; Mouser Part Number: *; Mouser Price/Stock: *; Manufacturer_Part_Number: IHLP1212BZEZ1R0M1Z; Datasheet Link: https://www.vishay.com/docs/34671/ihlp1212-ez-1z.pdf
R19 = RT0805BRD07732KL: Thin Film Resistors - SMD 732 kOhms 25PPM/C 125mW 0805 10%; Case/Package: 0805
R20 = RT0603FRD07100KL: Thin Film Resistors - SMD 100K OHM 1% 25PPM 1/10W; Case/Package: 0603
U4 = TPS61022RWUR: 8-A boost converter with 0.5-V ultra-low input voltage; Manufacturer_Name: Texas Instruments; Geometry.Height: 1mm; Mouser Part Number: 595-TPS61022RWUR; Mouser Price/Stock: https://www.mouser.co.uk/ProductDetail/Texas-Instruments/TPS61022RWUR?qs=vLWxofP3U2zlxrk4cD0iFA%3D%3D; Manufacturer_Part_Number: TPS61022RWUR; Datasheet Link: http://www.ti.com/lit/gpn/TPS61022

## Sheet SME_tps63021.SchDoc: Titulo
size OrCAD A; Author: Ismael Poblete V.; CompanyName: SME; Organization: SME; Address1: Santiago, Chile; DocumentNumber: SME-UNO; Revision: 1.0; SheetNumber: 3; SheetTotal: 7
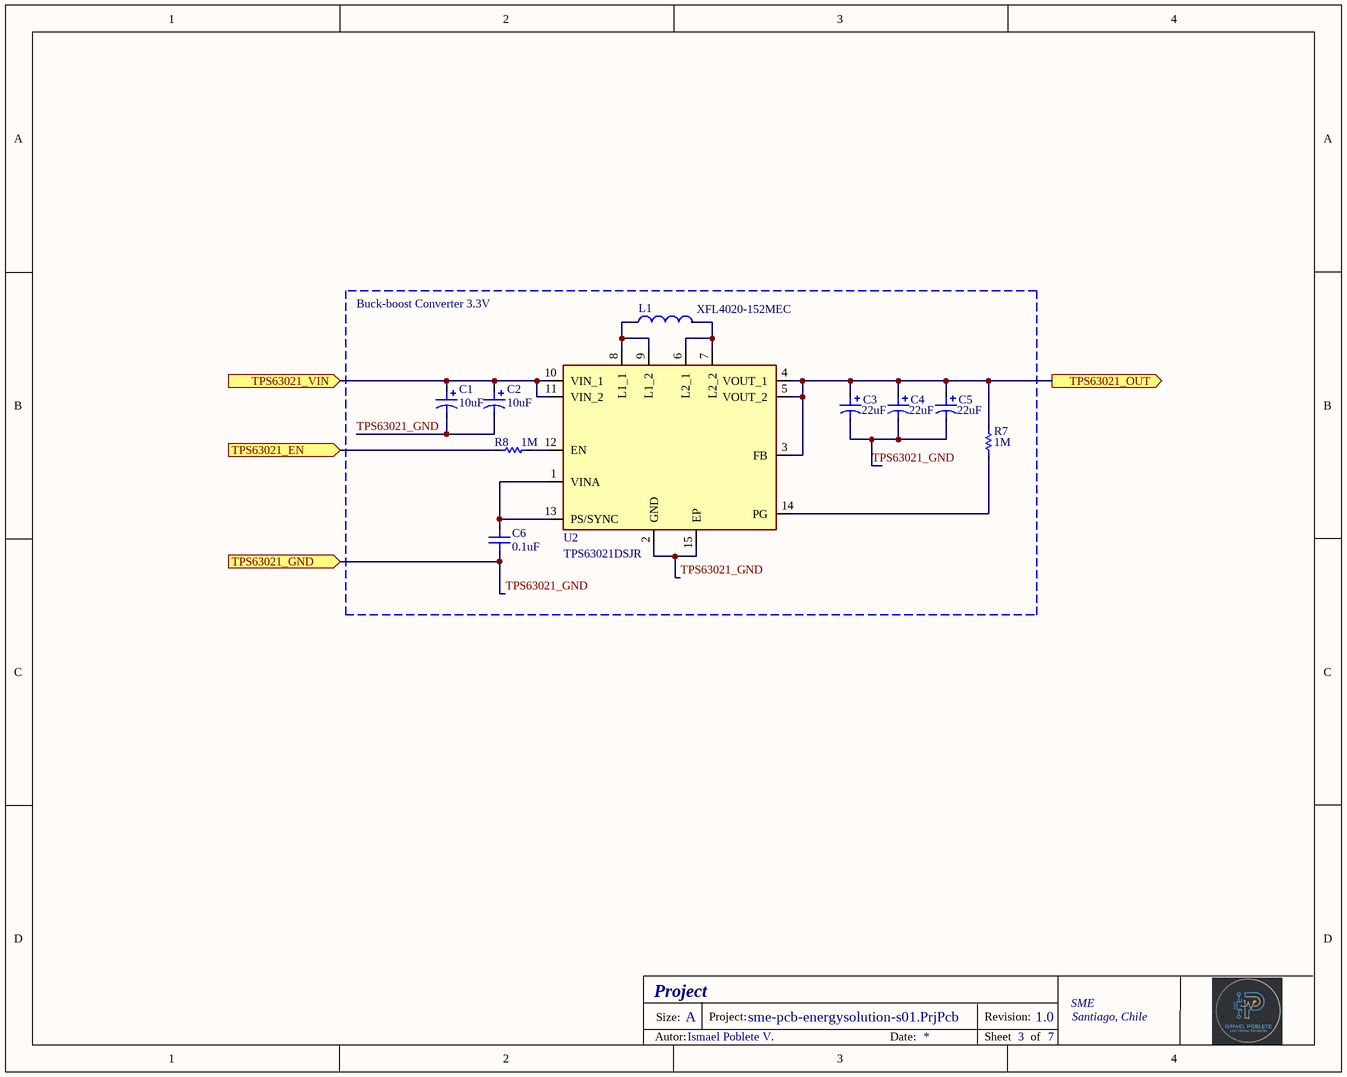
[diagram p5: SME_tps63021.SchDoc]

### Parts
C1  Capacitance: 10uF  [CASE_A]  (hidden comment: T491A106M016AT)
C2  Capacitance: 10uF  [CASE_A]  (hidden comment: T491A106M016AT)
C3  Capacitance: 22uF  [T491B / CASE_B]  (hidden comment: T491B226K006AT)
C4  Capacitance: 22uF  [T491B / CASE_B]  (hidden comment: T491B226K006AT)
C5  Capacitance: 22uF  [T491B / CASE_B]  (hidden comment: T491B226K006AT)
C6  Capacitance: 0.1uF  [C0603]  (hidden comment: CC0603KRX7R9BB104)
L1  XFL4020-152MEC  [XFL4020152MEC]
R7  Resistance: 1M  [RES_0603]  (hidden comment: RT0603FRE071ML)
R8  Resistance: 1M  [RES_0603]  (hidden comment: RT0603FRE071ML)
U2  TPS63021DSJR  [VSON-14]

### Blocks framed on the sheet
Buck-boost Converter 3.3V: C1-C6 L1 R7 R8 U2

### Ports
TPS63021_EN (in, see SME_Main[3B]), TPS63021_GND (in, see SME_Main[4B]), TPS63021_OUT (out, see SME_Main[4B]), TPS63021_VIN (in, see SME_Main[3B])

### Nets
TPS63021_GND: C1.2 C2.2 C3.2 C4.2 C5.2 C6.1 U2.2(GND) U2.15(EP) ; port TPS63021_GND  [project net MP2759GQ_AGND]
NetC1_1: C1.1 C2.1 U2.10(VIN_1) U2.11(VIN_2) ; port TPS63021_VIN
NetC3_1: C3.1 C4.1 C5.1 R7.2 U2.3(FB) U2.4(VOUT_1) U2.5(VOUT_2) ; port TPS63021_OUT
NetC6_2: C6.2 U2.1(VINA) U2.13(PS/SYNC)
NetL1_1: L1.1 U2.8(L1_1) U2.9(L1_2)
NetL1_2: L1.2 U2.6(L2_1) U2.7(L2_2)
NetR7_1: R7.1 U2.14(PG)
NetR8_1: R8.1 ; port TPS63021_EN
NetR8_2: R8.2 U2.12(EN)

### Notes on the sheet
- Project
- Size:
- A
- Project:
- Revision:
- Autor:
- Date:
- Sheet
- of

### Library data of the parts
C1 C2 = T491A106M016AT: as C7 on sheet SME_mp2759gq; Supplier 1: Digi-Key; Supplier Part Number 1: 1276-1192-1-ND; Manufacturer Part Number: T491A106M016AT; RoHS: Yes; Category: Ceramic Capacitors; Stock 1: 1573745; Pricing 1: 1=0.19000, 10=0.13200, 50=0.07940, 100=0.06700, 500=0.04588, 1000=0.04058 (USD); Mount: Surface Mount; Case/Package: 0603; Case Code (Metric): 1608; Case Code (Imperial): 0603; Contact Plating: Tin; Min Operating Temperature: -55°C; Max Operating Temperature: 85°C; Package Quantity: 1; Packaging: Tape and Reel; Voltage Rating: 10V; Length: 1.6mm; Height: 0.8mm; Thickness: 0.035inch; Depth: 0.8mm; Width: 0.031inch; Radiation Hardening: No; Lead Free: Lead Free; ComponentLink1URL: https://datasheet.ciiva.com/26877/getdatasheetpartid-359551-26877881.pdf?src-supplier=Verical; ComponentLink1Description: https://datasheet.ciiva.com/26877/getdatasheetpartid-359551-26877881.pdf?src-supplier=Verical; ComponentLink2URL: https://datasheet.ciiva.com/29198/457369-da-01-en-vs-kondensator-0603-29198790.pdf?src-supplier=Conrad; ComponentLink2Description: https://datasheet.ciiva.com/29198/457369-da-01-en-vs-kondensator-0603-29198790.pdf?src-supplier=Conrad; ComponentLink3URL: https://datasheet.ciiva.com/16200/cl05b104kq5nnnc-16200766.pdf?src-supplier=Future+Electronics; ComponentLink3Description: https://datasheet.ciiva.com/16200/cl05b104kq5nnnc-16200766.pdf?src-supplier=Future+Electronics; Supplier 2: Digi-Key; Supplier Part Number 2: 399-3687-1-ND; Stock 2: 249031; Pricing 2: 1=0.43000, 10=0.29900, 50=0.20940, 100=0.17950, 500=0.13464, 1000=0.11370 (USD); Dielectric Material: Tantalum; Features: General Purpose; Termination: SMD/SMT; Height - Seated (Max): 0.071inch; Lead Pitch: 1.2mm; REACH SVHC: No SVHC; ComponentLink4URL: https://datasheet.ciiva.com/27092/1573281-27092884.pdf?src-supplier=Jameco; ComponentLink4Description: https://datasheet.ciiva.com/27092/1573281-27092884.pdf?src-supplier=Jameco; ComponentLink5URL: https://datasheet.ciiva.com/7696/1732759-7696297.pdf?src-supplier=Element14; ComponentLink5Description: https://datasheet.ciiva.com/7696/1732759-7696297.pdf?src-supplier=Element14; ComponentLink6URL: https://datasheet.ciiva.com/7696/1854511-7696298.pdf?src-supplier=Element14; ComponentLink6Description: https://datasheet.ciiva.com/7696/1854511-7696298.pdf?src-supplier=Element14; ComponentLink7URL: https://datasheet.ciiva.com/257/kem-t2005-t491-257611.pdf?src-supplier=Digi-Key; ComponentLink7Description: https://datasheet.ciiva.com/257/kem-t2005-t491-257611.pdf?src-supplier=Digi-Key; ComponentLink8URL: https://datasheet.ciiva.com/5934/kem-t2005-t491-5934795.pdf?src-supplier=Farnell; ComponentLink8Description: https://datasheet.ciiva.com/5934/kem-t2005-t491-5934795.pdf?src-supplier=Farnell; ComponentLink9URL: https://datasheet.ciiva.com/257/kem-t2005-t491-257612.pdf?src-supplier=Digi-Key; ComponentLink9Description: https://datasheet.ciiva.com/257/kem-t2005-t491-257612.pdf?src-supplier=Digi-Key; ComponentLink10URL: https://datasheet.ciiva.com/257/kem-t2005-t491-257613.pdf?src-supplier=Digi-Key; ComponentLink10Description: https://datasheet.ciiva.com/257/kem-t2005-t491-257613.pdf?src-supplier=Digi-Key; ComponentLink11URL: https://datasheet.ciiva.com/12883/kem-t2005-t491-12883118.pdf?src-supplier=Mouser; ComponentLink11Description: https://datasheet.ciiva.com/12883/kem-t2005-t491-12883118.pdf?src-supplier=Mouser; ComponentLink12URL: https://datasheet.ciiva.com/14589/70095774-14589054.pdf?src-supplier=Allied+Electronics; ComponentLink12Description: https://datasheet.ciiva.com/14589/70095774-14589054.pdf?src-supplier=Allied+Electronics; ComponentLink13URL: https://datasheet.ciiva.com/14597/70095774-14597406.pdf?src-supplier=Allied+Electronics; ComponentLink13Description: https://datasheet.ciiva.com/14597/70095774-14597406.pdf?src-supplier=Allied+Electronics; Package: A Case
C3-C5 = T491B226K006AT: Tantalum Capacitors - Solid SMD 6.3V 22uF 1311 10% ESR=3.5ohms; Manufacturer: Yageo Group; Package: B Case; Type: SMD; Manufacturer Part Number: T491B226K006AT
C6 = CC0603KRX7R9BB104: as C10 on sheet SME_mp2759gq; Package: 0603; Manufacturer Part Number: CC0603KRX7R9BB104
L1 = XFL4020-152MEC: COILCRAFT - XFL4020-152MEC - Power Inductor (SMD), 1.5 H, 9.1 A, Shielded, 4.1 A, XFL4020; Geometry.Height: 2.1mm; Mouser Part Number: 994-XFL4020-152MEC; Mouser Price/Stock: https://www.mouser.co.uk/ProductDetail/Coilcraft/XFL4020-152MEC?qs=zCSbvcPd3pak5QYA2uujRA%3D%3D; Manufacturer_Name: COILCRAFT; Manufacturer_Part_Number: XFL4020-152MEC; Datasheet Link: https://www.coilcraft.com/getmedia/50632d43-da1b-4cdb-8ab4-3029cab51df3/xfl4020.pdf; Manufacturer: Coilcraft; Package: 1616; Type: SMD; Manufacturer Part Number: XFL4020-152MEC
R7 R8 = RT0603FRE071ML: Thin Film Resistors - SMD 1M OHM 1% 50PPM 1/10 W; Manufacturer: Yageo Group; Case/Package: 0603; Package: 0603; Type: SMD; Manufacturer Part Number: RT0603FRE071ML
U2 = TPS63021DSJR: High Efficiency Single Inductor Buck-Boost Converter with 4A Switch; Manufacturer_Name: Texas Instruments; Geometry.Height: 1mm; Mouser Part Number: 595-TPS63021DSJR; Mouser Price/Stock: https://www.mouser.co.uk/ProductDetail/Texas-Instruments/TPS63021DSJR?qs=C44r%252BX3hXgL5uT9uesn8fg%3D%3D; Manufacturer_Part_Number: TPS63021DSJR; Datasheet Link: http://www.ti.com/lit/gpn/tps63021; Manufacturer: Texas Instruments; Package: VSON-14; Type: SMD; Manufacturer Part Number: TPS63021DSJR

## Sheet SME_MP2759GQ_PowerPath.SchDoc: Titulo
size OrCAD A; Author: Ismael Poblete V.; CompanyName: SME; Organization: SME; Address1: Santiago, Chile; DocumentNumber: SME-UNO; Revision: 1.0; SheetNumber: 7; SheetTotal: 7
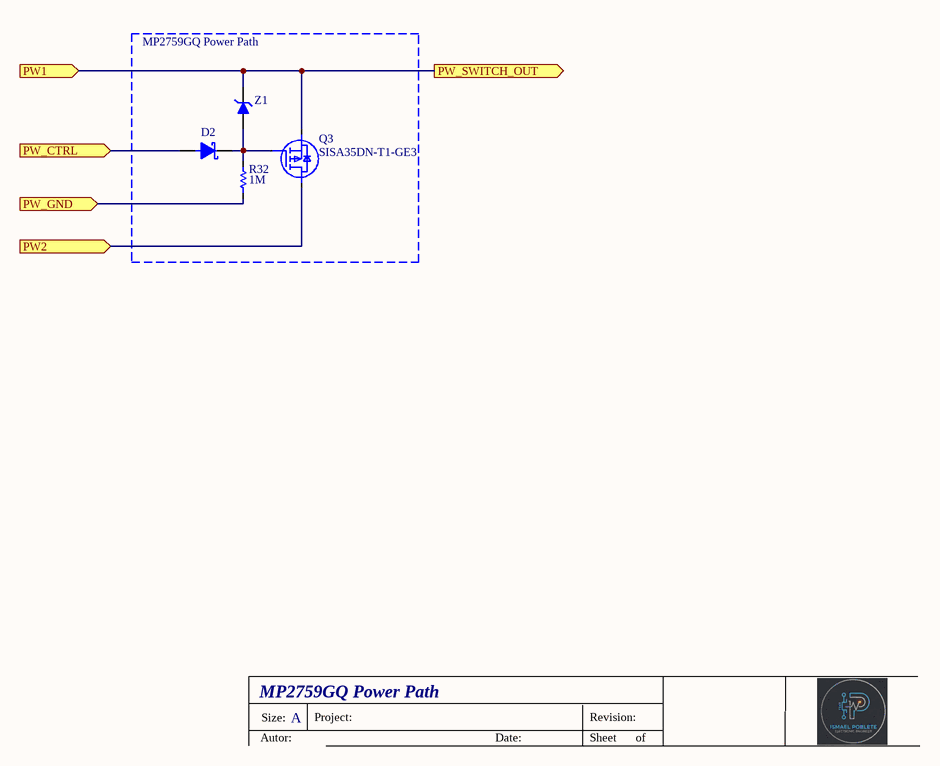
[diagram p6: SME_MP2759GQ_PowerPath.SchDoc]

### Parts
D2  CDBB240-HF  [DO-214AA-2]  (value not drawn)
Q3  SISA35DN-T1-GE3  [PowerPAK 1212-8-Pad]
R32  Resistance: 1M  [RES_0603]  (hidden comment: RT0603FRE071ML)
Z1  SZNZ8P12VMX2WT5G  [SOD-923]  (value not drawn)

### Blocks framed on the sheet
MP2759GQ Power Path: D2 Q3 R32 Z1

### Ports
PW1 (in, see SME_Main[2B]), PW2 (in, see SME_Main[2B]), PW_CTRL (in, see SME_Main[2B]), PW_GND (in, see SME_Main[2B]), PW_SWITCH_OUT (out, see SME_Main[2B])

### Nets
MP2759GQ_AGND: R32.1 ; port PW_GND
NetD2_1: D2.1(A) Q3.1(S) Z1.1(K) ; port PW_SWITCH_OUT, port PW1, port PW_CTRL
NetD2_2: D2.2(K) Q3.2(G) R32.2 Z1.2(A)
NetQ3_3: Q3.3(D) ; port PW2

### Notes on the sheet
- MP2759GQ Power Path
- Size:
- A
- Project:
- Revision:
- Autor:
- Date:
- Sheet
- of

### Library data of the parts
D2 = CDBB240-HF: Schottky Diode; Manufacturer_Name: Comchip Technology; Datasheet Link: https://datasheet.datasheetarchive.com/originals/distributors/DKDS41/DSANUWW0021461.pdf; Height: 3.2mm; Manufacturer_Part_Number: CDBB240-HF; Mouser Part Number: 750-CDBB240-HF; Mouser Price/Stock: https://www.mouser.co.uk/ProductDetail/Comchip-Technology/CDBB240-HF?qs=%252BiOMRfgENTHvuVH5OF%252BwbA%3D%3D; Arrow Part Number: CDBB240-HF; Arrow Price/Stock: https://www.arrow.com/en/products/cdbb240-hf/comchip-technology?region=nac
Q3 = SISA35DN-T1-GE3: MOSFET P-CHANNEL 30-V (D-S) PowerPAK 1212-8; Manufacturer_Name: Vishay; Geometry.Height: 1.17mm; Mouser Part Number: 78-SISA35DN-T1-GE3; Mouser Price/Stock: https://www.mouser.co.uk/ProductDetail/Vishay-Semiconductors/SISA35DN-T1-GE3?qs=xZ%2FP%252Ba9zWqbzg0tXMvfS4g%3D%3D; Manufacturer_Part_Number: SISA35DN-T1-GE3; Datasheet Link: https://www.vishay.com/docs/75831/sisa35dn.pdf
R32 = RT0603FRE071ML: Thin Film Resistors - SMD 1M OHM 1% 50PPM 1/10 W; Case/Package: 0603
Z1 = SZNZ8P12VMX2WT5G: Zener Diode; Manufacturer_Name: onsemi; Datasheet Link: https://www.onsemi.com/pub/Collateral/NZ8PMX2-D.PDF; Height: 0.4mm; Manufacturer_Part_Number: SZNZ8P12VMX2WT5G

## Nets that join several sheets
MP2759GQ_AGND: SME_Main (P1.1 P2.1 P4.1), SME_mic841 (R6.1 U1.2), SME_S8261 (Q2.3 R22.2), SME_mp2759gq (15 pins), SME_tps61022 (7 pins), SME_tps63021 (8 pins), SME_MP2759GQ_PowerPath (R32.1)
CTRL_REG: SME_Main (R25.1 R31.1), SME_mic841 (U1.4)
MP2759GQ_BAT+: SME_Main (R27.2), SME_mp2759gq (C11.1 R10.2 U3.14)
MP2759GQ_VIN: SME_Main (F1.2), SME_mp2759gq (6 pins)
NetC1_1: SME_Main (R23.2), SME_tps63021 (C1.1 C2.1 U2.10 U2.11)
NetC3_1: SME_Main (P2.2), SME_tps63021 (7 pins)
NetC9_2: SME_Main (R24.1), SME_mp2759gq (C9.2 D1.2 U3.2)
NetC13_1: SME_Main (R30.2), SME_tps61022 (C13.1 C14.2 L3.1 U4.7)
NetC15_1: SME_Main (P4.2), SME_tps61022 (5 pins)
NetC18_1: SME_Main (P3.1), SME_S8261 (C18.1 Q1.3 U5.6)
NetD2_1: SME_Main (R23.1 R24.2 R26.1 R30.1), SME_MP2759GQ_PowerPath (D2.1 Q3.1 Z1.1)
NetQ3_3: SME_Main (R28.2), SME_MP2759GQ_PowerPath (Q3.3)
NetR1_2: SME_Main (R26.2), SME_mic841 (R1.2 U1.5)
NetR8_1: SME_Main (R25.2), SME_tps63021 (R8.1)
NetR21_1: SME_Main (R29.1), SME_S8261 (R21.1)
NetR31_2: SME_Main (R31.2), SME_tps61022 (U4.5 U4.6)